# Altium schematic sheet RGB Driver.SchDoc
size A4; SheetNumber: 10; SheetTotal: 11
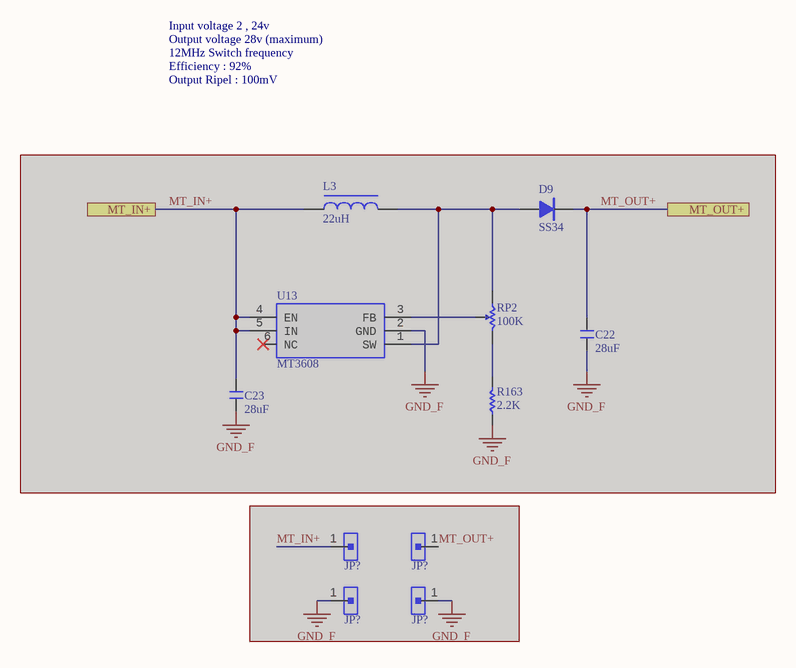
[diagram p0: RGB Driver.SchDoc]

## Parts
(Parts that share a designator on the sheet are numbered #1, #2 ... from top to bottom, then left to right.)
C22  28uF  [C 0805]  (masked out: inside a compile mask, not in the netlist)
C23  28uF  [C 0805]  (masked out: inside a compile mask, not in the netlist)
D9  SS34  [SMA]  (masked out: inside a compile mask, not in the netlist)
JP?#1  HDR-1X1  [HDR-1X1]  (value not drawn)  (masked out: inside a compile mask, not in the netlist)
JP?#2  HDR-1X1  [HDR-1X1]  (value not drawn)  (masked out: inside a compile mask, not in the netlist)
JP?#3  HDR-1X1  [HDR-1X1]  (value not drawn)  (masked out: inside a compile mask, not in the netlist)
JP?#4  HDR-1X1  [HDR-1X1]  (value not drawn)  (masked out: inside a compile mask, not in the netlist)
L3  22uH  [CD104]  (masked out: inside a compile mask, not in the netlist)
R163  2.2K  [R 0805]  (masked out: inside a compile mask, not in the netlist)
RP2  100K  [3296W]  (masked out: inside a compile mask, not in the netlist)
U13  MT3608  [SOT23-6N]  (masked out: inside a compile mask, not in the netlist)

## Ports
MT_IN+, MT_OUT+

## Notes on the sheet
- Input voltage 2 , 24v
- Output voltage 28v (maximum)
- 12MHz Switch frequency
- Efficiency : 92%
- Output Ripel : 100mV

## Library data of the parts
C22 C23 = C: Non-polar patch capacitor; BOM名称: 无极性贴片电容; 版权归属: 源创客; 学习资源: www.ooocke.com
D9 = SS34: Schottky diodes; BOM名称: 肖特基二极管; 版权归属: 源创客; 属性: 40V/3A; 学习资源: www.ooocke.com
JP?#1-JP?#4 = Header 1: 1P Connector; BOM名称: 1P接插件; 版权归属: 源创客; 学习资源: www.ooocke.com
L3 = L-CD: Chip power inductor; BOM名称: 功率电感; 版权归属: 源创客; 学习资源: www.ooocke.com
R163 = R: Chip resistor; 版权归属: 源创客; BOM名称: Chip resistor; 学习资源: www.ooocke.com
RP2 = RP-THD: Plug-in potentiometer; BOM名称: 插件电位器; 版权归属: 源创客; 学习资源: www.ooocke.com
U13 = MT3608: 1.2MHz 2A Step Up Converter